# Altium schematic sheet MCU_USB.SchDoc
size A3
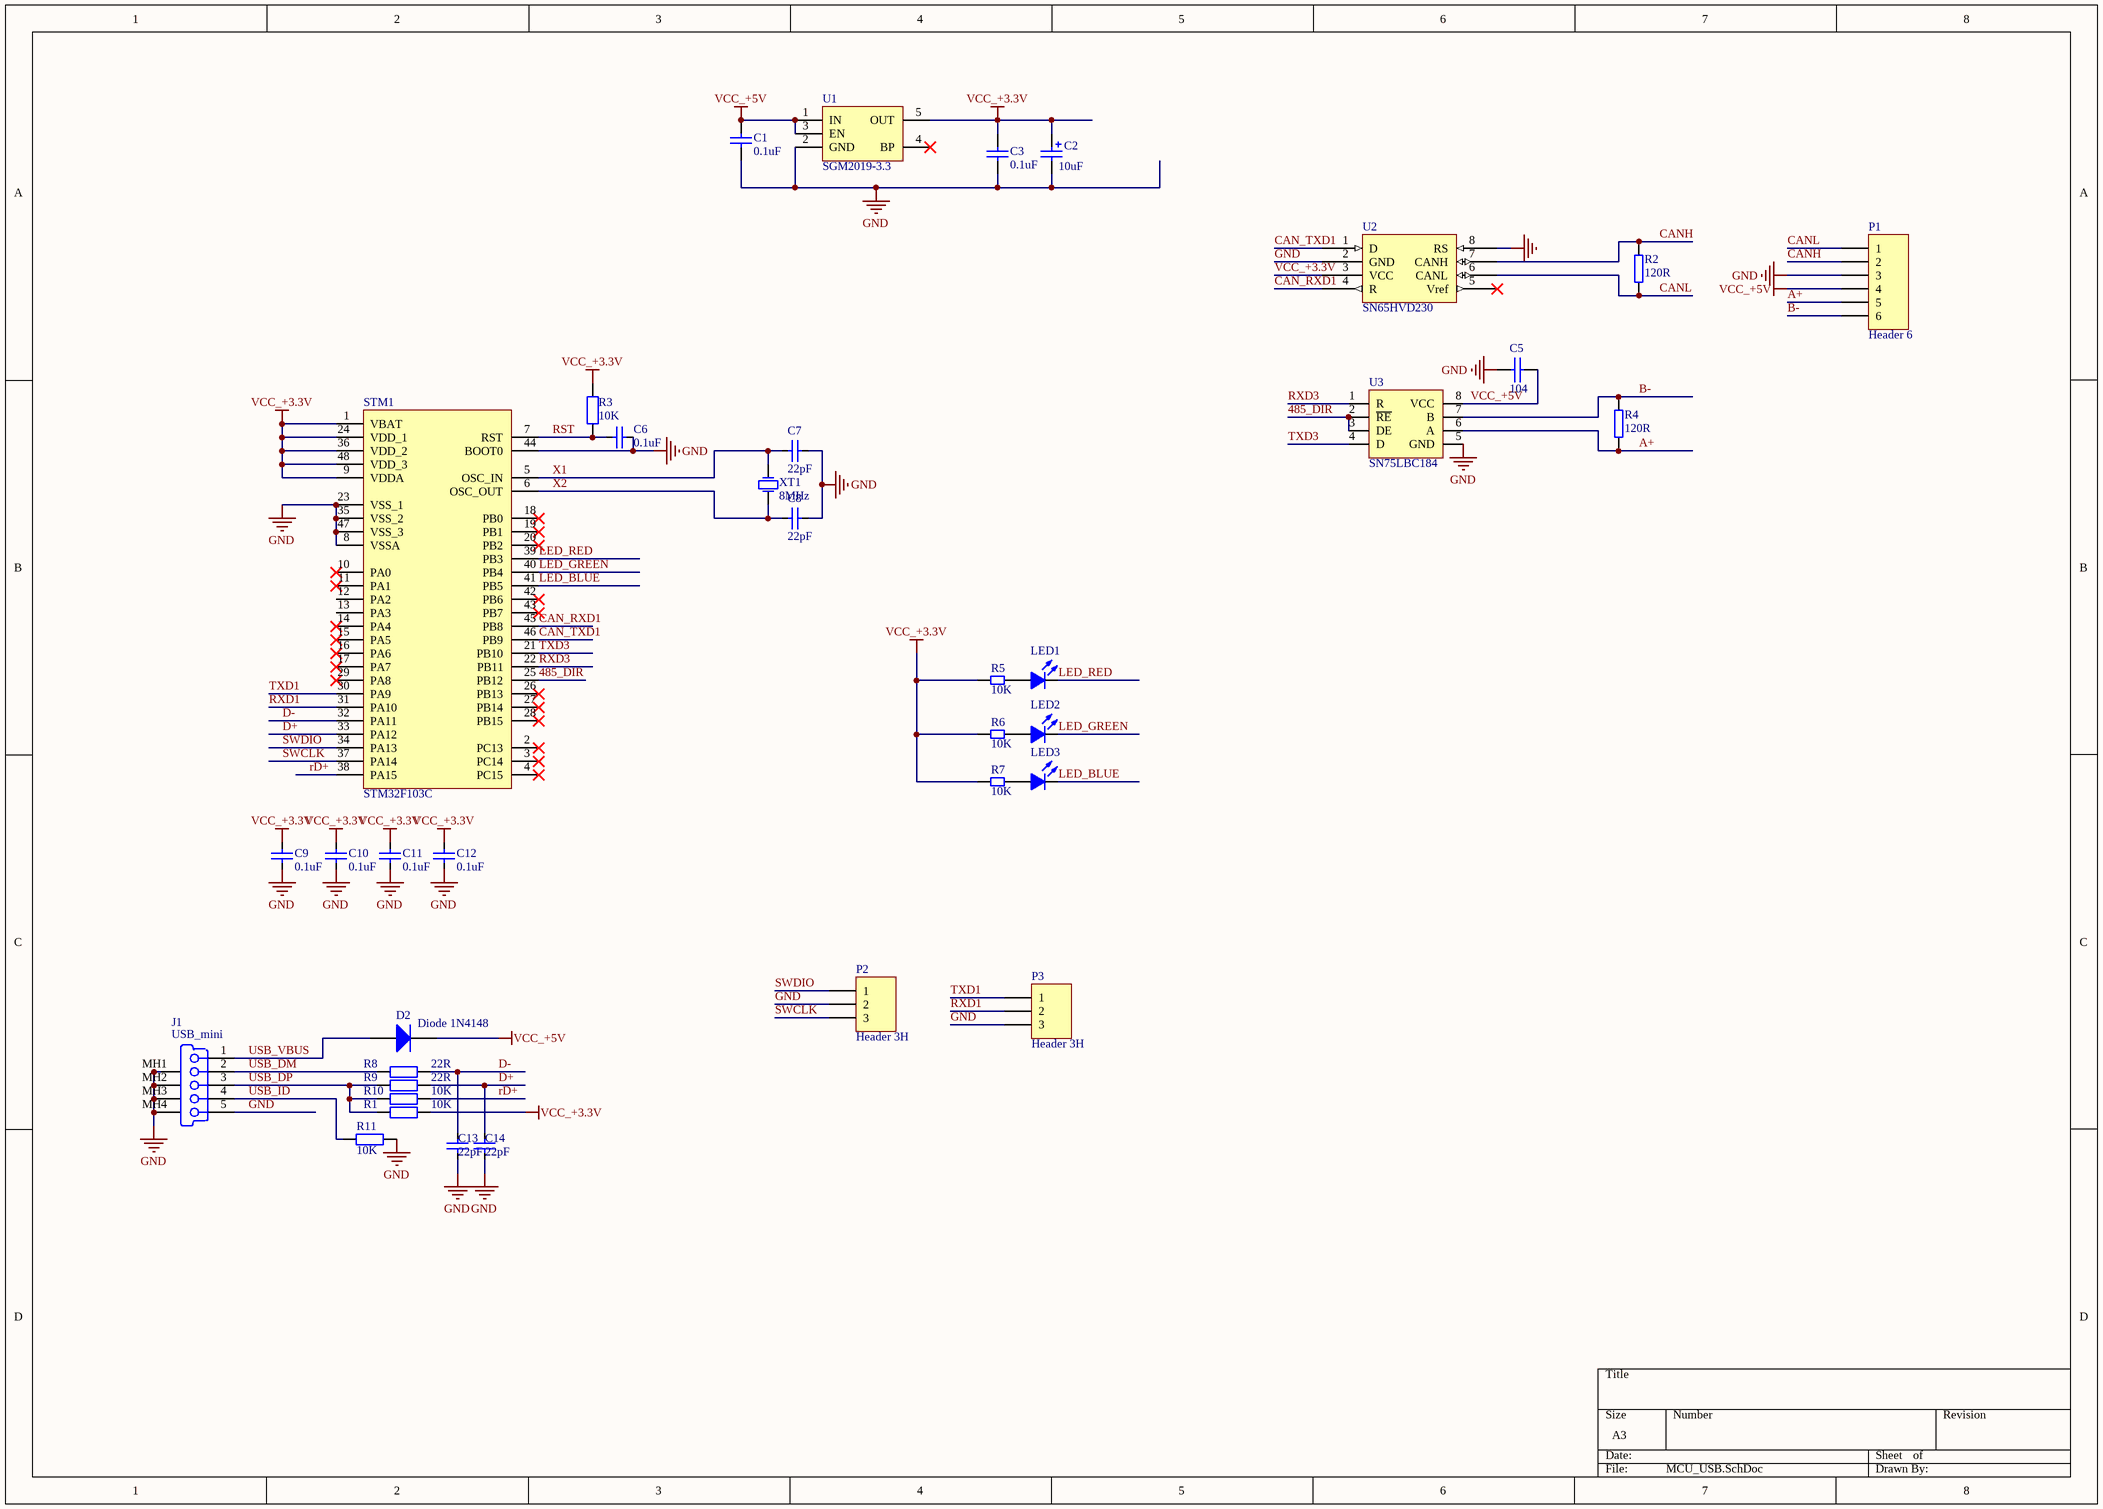
[diagram p0: MCU_USB.SchDoc]

## Parts
C1  0.1uF  [0603C]
C2  10uF  [1812C]
C3  0.1uF  [0603C]
C5  104  [0603C]
C6  value 0.1uF  [0603C]  (hidden comment: Cap_0603)
C7  value 22pF  [0603C]  (hidden comment: Cap_0603)
C8  value 22pF  [0603C]  (hidden comment: Cap_0603)
C9  value 0.1uF  [0603C]  (hidden comment: Cap_0603)
C10  value 0.1uF  [0603C]  (hidden comment: Cap_0603)
C11  value 0.1uF  [0603C]  (hidden comment: Cap_0603)
C12  value 0.1uF  [0603C]  (hidden comment: Cap_0603)
C13  value 22pF  [0603C]  (hidden comment: Cap_0603)
C14  value 22pF  [0603C]  (hidden comment: Cap_0603)
D2  Diode 1N4148  [1206D]
J1  USB_mini  [USB]
LED1  LED  [LED-0603]  (value not drawn)
LED2  LED  [LED-0603]  (value not drawn)
LED3  LED  [LED-0603]  (value not drawn)
P1  Header 6  [HDR1X6]
P2  Header 3H  [SIP3B]
P3  Header 3H  [SIP3B]
R1  value 10K  [0603R]  (hidden comment: Res_0603)
R2  120R  [0603R]
R3  value 10K  [0603R]  (hidden comment: Res_0603)
R4  120R  [0603R]
R5  10K  [0603R]
R6  10K  [0603R]
R7  10K  [0603R]
R8  value 22R  [0603R]  (hidden comment: Res_0603)
R9  value 22R  [0603R]  (hidden comment: Res_0603)
R10  value 10K  [0603R]  (hidden comment: Res_0603)
R11  value 10K  [0603R]  (hidden comment: Res_0603)
STM1  STM32F103C  [STM32F_48]
U1  SGM2019-3.3  [SOT23-5]
U2  SN65HVD230  [SOP8]
U3  SN75LBC184  [SOP8]
XT1  value 8MHz  [5032SMD]  (hidden comment: XTAL_5032)

## Nets
GND: C1.1 C2.2 C3.1 C5.1 C6.1 C7.1 C8.1 C9.1 C10.1 C11.1 C12.1 C13.2 C14.2 J1.5(GND) J1.MH1(Tab) J1.MH2(Tab) J1.MH3(Tab) J1.MH4(Tab) P1.3 P2.2 P3.3 R11.1 STM1.8(VSSA) STM1.23(VSS_1) STM1.35(VSS_2) STM1.44(BOOT0) STM1.47(VSS_3) U1.2(GND) U2.2(GND) U2.8(RS) U3.5(GND)
VCC_+3.3V: C2.1 C3.2 C9.2 C10.2 C11.2 C12.2 R1.2 R3.1 R5.1 R6.1 R7.1 STM1.1(VBAT) STM1.9(VDDA) STM1.24(VDD_1) STM1.36(VDD_2) STM1.48(VDD_3) U1.5(OUT) U2.3(VCC)
VCC_+5V: C1.2 C5.2 D2.2(K) P1.4 U1.1(IN) U1.3(EN) U3.8(VCC)
485_DIR: STM1.25(PB12) U3.2(~{RE}) U3.3(DE)
A+: P1.5 R4.2 U3.6(A)
B-: P1.6 R4.1 U3.7(B)
CAN_RXD1: STM1.45(PB8) U2.4(R)
CAN_TXD1: STM1.46(PB9) U2.1(D)
CANH: P1.2 R2.1 U2.7(CANH)
CANL: P1.1 R2.2 U2.6(CANL)
D+: C14.1 R9.1 STM1.33(PA12)
D-: C13.1 R8.1 STM1.32(PA11)
LED_BLUE: LED3.2(K) STM1.41(PB5)
LED_GREEN: LED2.2(K) STM1.40(PB4)
LED_RED: LED1.2(K) STM1.39(PB3)
rD+: R10.2 STM1.38(PA15)
RST: C6.2 R3.2 STM1.7(RST)
RXD1: P3.2 STM1.31(PA10)
RXD3: STM1.22(PB11) U3.1(R)
SWCLK: P2.3 STM1.37(PA14)
SWDIO: P2.1 STM1.34(PA13)
TXD1: P3.1 STM1.30(PA9)
TXD3: STM1.21(PB10) U3.4(D)
USB_DM: J1.2(D-) R8.2
USB_DP: J1.3(D+) R1.1 R9.2 R10.1
USB_ID: J1.4(NC) R11.2
USB_VBUS: D2.1(A) J1.1(V_BUS_(5V))
X1: C7.2 STM1.5(OSC_IN) XT1.1(OSC1)
X2: C8.2 STM1.6(OSC_OUT) XT1.2(OSC2)
NetLED1_1: LED1.1(A) R5.2
NetLED2_1: LED2.1(A) R6.2
NetLED3_1: LED3.1(A) R7.2

Not connected (* = marked no-connect by the designer): STM1 2(PC13)* 3(PC14)* 4(PC15)* 10(PA0)* 11(PA1)* 12(PA2) 13(PA3) 14(PA4)* 15(PA5)* 16(PA6)* 17(PA7)* 18(PB0)* 19(PB1)* 20(PB2)* 26(PB13)* 27(PB14)* 28(PB15)* 29(PA8)* 42(PB6)* 43(PB7)*; U1 4(BP)*; U2 5(Vref)*

## Library data of the parts
C1 C3 = Cap: Capacitor; Value: 104; Published: 8-Jun-2000; LatestRevisionDate: 17-Jul-2002; LatestRevisionNote: Re-released for DXP Platform.; Publisher: Altium Limited
C2 = Cap Pol: Polarized Capacitor (Radial); Published: 8-Jun-2000; LatestRevisionDate: 17-Jul-2002; LatestRevisionNote: Re-released for DXP Platform.; Publisher: Altium Limited; Value: 10uF
C5 = 0603C
C6-C14 = Cap_0603: Capacitor
D2 = Diode 1N4148: High Conductance Fast Diode; Published: 8-Jun-2000; LatestRevisionDate: 17-Jul-2002; LatestRevisionNote: Re-released for DXP Platform.; DatasheetVersion: 1997; PackageReference: DO-35; Publisher: Altium Limited; PackageDescription: Diode, Axial; Body 3.8 x 1.9 mm (LxDia. max), Lead Dia. 0.53 mm (max); Code_JEDEC: DO-204-AH; ComponentLink1Description: Manufacturer Link; ComponentLink1URL: http://www.fairchildsemi.com/; ComponentLink2Description: Datasheet; ComponentLink2URL: http://www.fairchildsemi.com/ds/1N%2F1N4148.pdf
J1 = 0481900001: USB On-The-Go (OTG) Mini-B Receptacle, Right Angle, SMT, 0.80mm (.031") Pitch, Solder Tabs with Back Cover, Recessed Type
LED1-LED3 = LED: Typical INFRARED GaAs LED; Published: 8-Jun-2000; LatestRevisionDate: 17-Jul-2002; LatestRevisionNote: Re-released for DXP Platform.; Publisher: Altium Limited
P1 = Header 6: Header, 6-Pin; LatestRevisionDate: 17-Jul-2002; LatestRevisionNote: Re-released for DXP Platform.; Publisher: Altium Limited
P2 P3 = Header 3H: Header, 3-Pin, Right Angle; LatestRevisionDate: 17-Jul-2002; LatestRevisionNote: Re-released for DXP Platform.; Publisher: Altium Limited
R1 R3 R8-R11 = Res_0603: Resistor
R2 R4 = RES2A
R5-R7 = Res2: Resistor; Value: 1K; Published: 8-Jun-2000; LatestRevisionDate: 17-Jul-2002; LatestRevisionNote: Re-released for DXP Platform.; Publisher: Altium Limited
STM1 = STM32F103C: MCU
U1 = SGM2019
U2 = SN65HVD230D
XT1 = XTAL_5032: Crystal Oscillator; Published: 8-Jun-2000; LatestRevisionDate: 17-Jul-2002; LatestRevisionNote: Re-released for DXP Platform.; PackageReference: R38; Publisher: Altium Limited; PackageDescription: Crystal, Thru-Hole; 2 Leads; Body 3.1 x 8.2 mm (Dia.xH)